# Altium schematic sheet project.schdoc
size A4
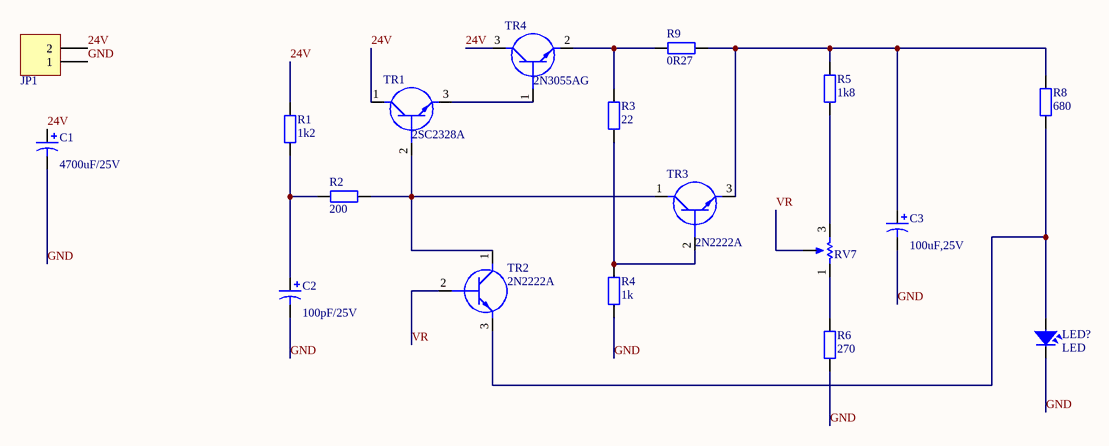
[diagram p0: project.schdoc]

## Parts
C1  value 4700uF/25V  [CP2/5]
C2  value 100pF/25V  [CP2/5]  (hidden comment: Cap Pol3)
C3  Cap Pol 3mm  [C3MM]  (value not drawn)
JP1  Header 2_1  [HED2]  (value not drawn)
LED?  LED  [LED-3]
R1  1k2  [R1/4W]
R2  200  [R1/4W]
R3  22  [R1/4W]
R4  1k  [R1/4W]
R5  1k8  [R1/4W]
R6  270  [R1/4W]
R8  680  [R1/4W]
R9  0R27  [R1/4W]
RV7  200  [RVAR10K]  (value not drawn)
TR1  2SC2328A  [2N2222A]
TR2  2N2222A  [2N2222A]
TR3  2N2222A  [2N2222A]
TR4  2N3055AG  [TO-204]

## Nets
24V: C1.1 JP1.2 R1.2 TR1.1(C) TR4.3(C)
GND: C1.2 C2.2 C3.2 JP1.1 LED?.2 R4.1 R6.1
VR: RV7.2 TR2.2(B)
NetC2_1: C2.1 R1.1 R2.1
NetC3_1: C3.1 R5.2 R8.2 R9.2 TR3.3(E)
NetLED?_1: LED?.1 R8.1 TR2.3(E)
NetR2_2: R2.2 TR1.2(B) TR2.1(C) TR3.1(C)
NetR3_1: R3.1 R4.2 TR3.2(B)
NetR3_2: R3.2 R9.1 TR4.2(E)
NetR5_1: R5.1 RV7.3
NetR6_2: R6.2 RV7.1
NetTR1_3: TR1.3(E) TR4.1(B)

## Notes on the sheet
- (in symbol Cap Pol 3mm) 100uF,25V

## Library data of the parts
C1 C2 = Cap Pol3: Polarized Capacitor (Surface Mount); VALUE: C?; LatestRevisionDate: 17-Jul-2002; LatestRevisionNote: Re-released for DXP Platform.; PackageReference: C0805; Publisher: Altium Limited
C3 = Cap Pol 3mm: Polarized Capacitor (Axial); Published: 8-Jun-2000; LatestRevisionDate: 17-Jul-2002; LatestRevisionNote: Re-released for DXP Platform.; PackageReference: POLAR0.8; Publisher: Altium Limited
JP1 = Header 2_1: Header, 2-Pin; Manufacturer: Generic Components; Class: Connector; Value: Header 2
LED? = LED: LED Single colour Green and Red; Value: LED 3 ly Single Colour
R1-R6 R8 R9 = R1/4W: Resistor 1/4W; Value: R1/4W - 1K
RV7 = Variable Resistor: Sim Note: Enter the Resistance value and the set point into parameter fields.; Set Position: 0.5; Published: 8-Jun-2000; LatestRevisionDate: 17-Jul-2002; LatestRevisionNote: Re-released for DXP Platform.; PackageReference: VR5; Publisher: Altium Limited
TR1-TR3 = 2N2222A: Transistor BJT NPN; Manufacturer_Name: Foshan Blue Rocket Elec; Datasheet Link: https://datasheet.lcsc.com/szlcsc/1901291437_Foshan-Blue-Rocket-Elec-2N2222A_C358533.pdf; Height: 4.7mm; Manufacturer_Part_Number: 2N2222A
TR4 = 2N3055AG: Transistor BJT NPN; Manufacturer_Name: ON Semiconductor; Datasheet Link: http://www.onsemi.com/pub/Collateral/2N3055A-D.PDF; Manufacturer_Part_Number: 2N3055AG; Mouser Part Number: 863-2N3055AG; Mouser Price/Stock: https://www.mouser.co.uk/ProductDetail/ON-Semiconductor/2N3055AG?qs=vLkC5FC1VN8e7R5UBGEUlg%3D%3D; Arrow Part Number: 2N3055AG; Arrow Price/Stock: https://www.arrow.com/en/products/2n3055ag/on-semiconductor